# EAGLE design esquemático (EAGLE 9.6.2)
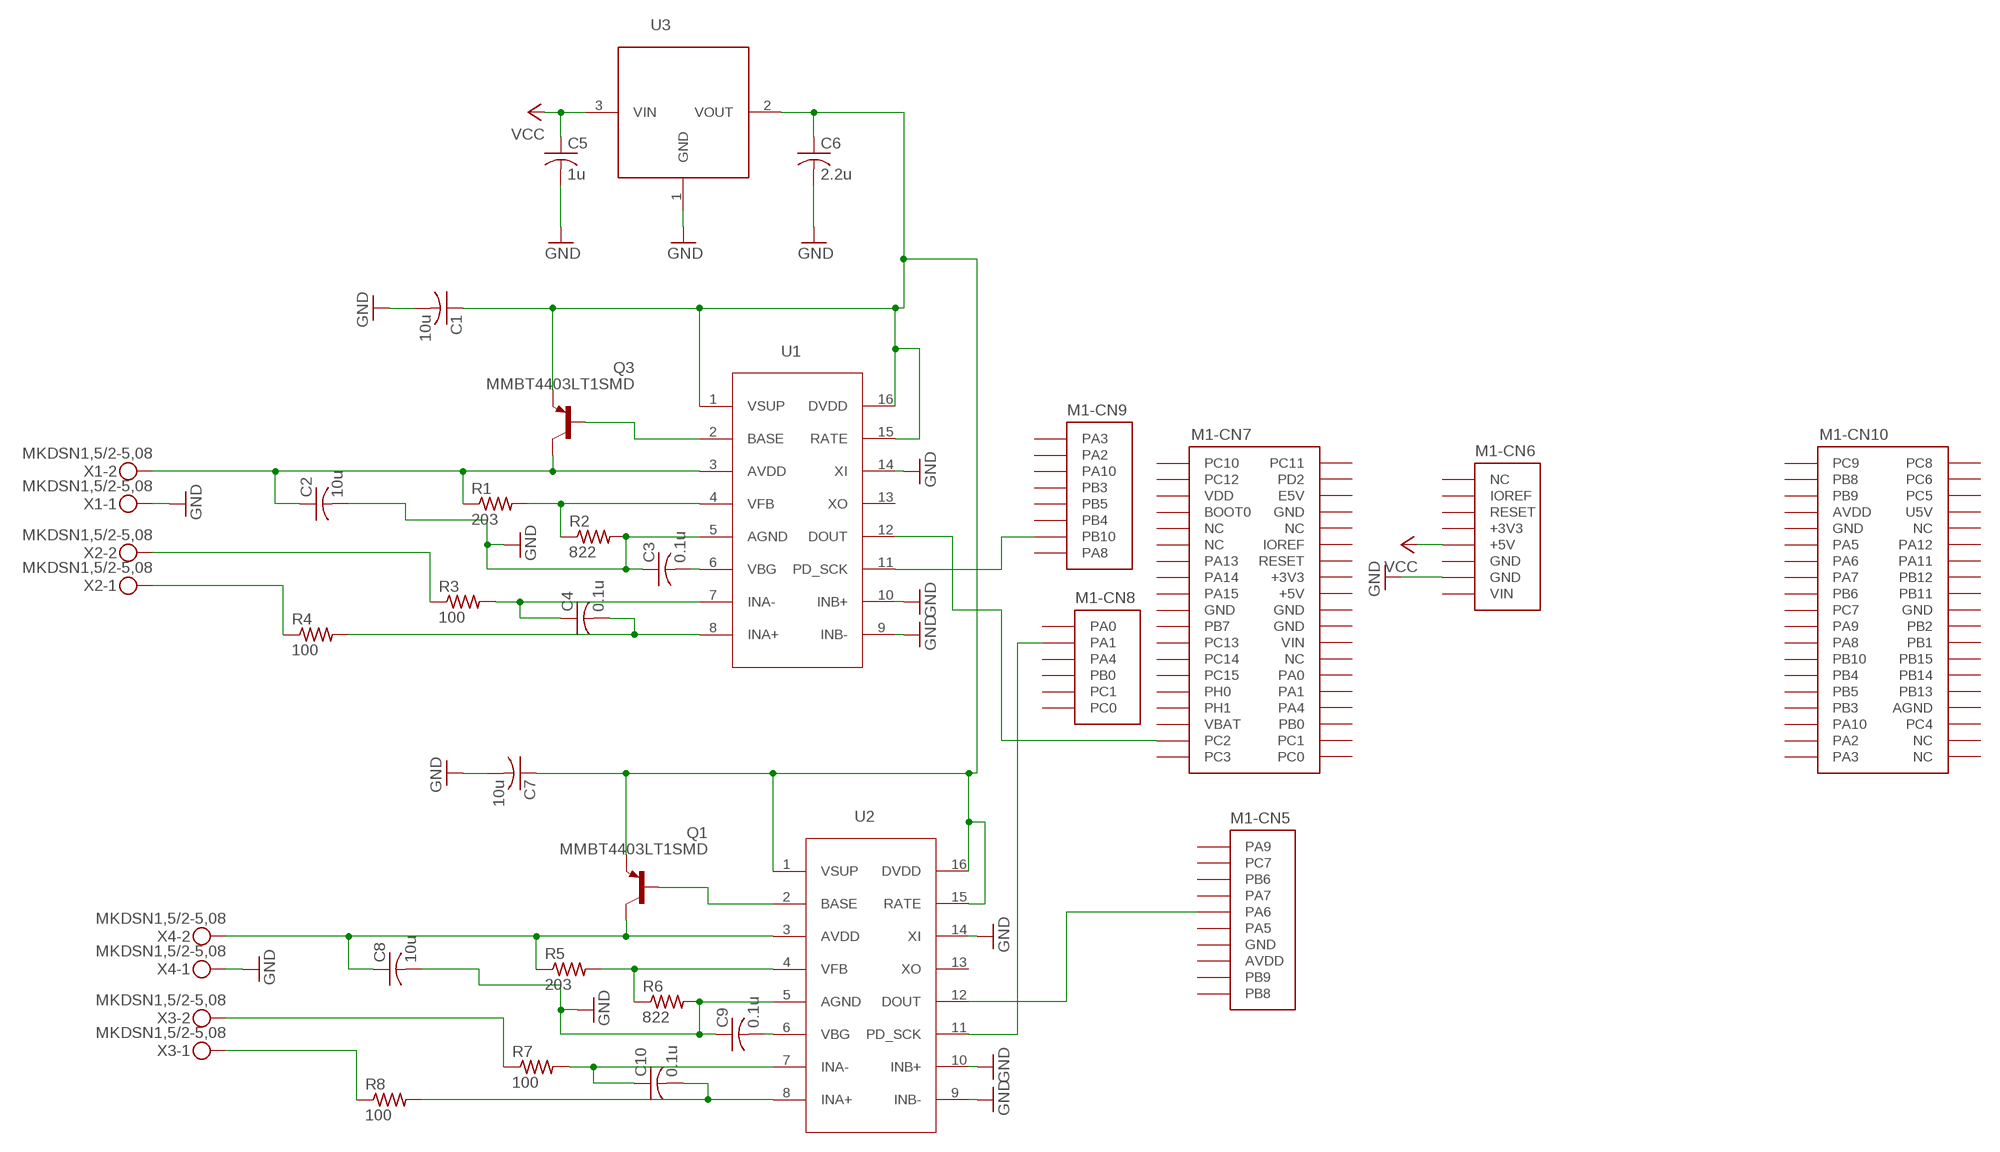
[diagram p0: schematic, sheet 1]

## Parts
C1  10u  C-USC0805  [C0805]
C2  10u  C-USC0805  [C0805]
C3  0.1u  C-USC0805  [C0805]
C4  0.1u  C-USC0805  [C0805]
C5  1u  C-USC0805  [C0805]
C6  2.2u  C-USC0805  [C0805]
C7  10u  C-USC0805  [C0805]
C8  10u  C-USC0805  [C0805]
C9  0.1u  C-USC0805  [C0805]
C10  0.1u  C-USC0805  [C0805]
M1  NUCLEO-L452RE  [NUCLEO-64]
Q1  MMBT4403LT1SMD  [SOT23-BEC]
Q3  MMBT4403LT1SMD  [SOT23-BEC]
R1  203  R-US_R0805  [R0805]
R2  822  R-US_R0805  [R0805]
R3  100  R-US_R0805  [R0805]
R4  100  R-US_R0805  [R0805]
R5  203  R-US_R0805  [R0805]
R6  822  R-US_R0805  [R0805]
R7  100  R-US_R0805  [R0805]
R8  100  R-US_R0805  [R0805]
U1  HX711SOIC127P600X140-16N  [SOIC127P600X140-16N]
U2  HX711SOIC127P600X140-16N  [SOIC127P600X140-16N]
U3  AP2210N-4.0TRG1  [SOT-23-3]
X1  MKDSN1,5/2-5,08  [MKDSN1,5/2-5,08]
X2  MKDSN1,5/2-5,08  [MKDSN1,5/2-5,08]
X3  MKDSN1,5/2-5,08  [MKDSN1,5/2-5,08]
X4  MKDSN1,5/2-5,08  [MKDSN1,5/2-5,08]

## Nets
GND: C1.2 C2.2 C3.1 C5.2 C6.2 C7.2 C8.2 C9.1 M1.CN6-7(-CN6:GND) R2.2 R6.2 U1.5(AGND) U1.9(INB-) U1.10(INB+) U1.14(XI) U2.5(AGND) U2.9(INB-) U2.10(INB+) U2.14(XI) U3.1(GND) X1.1 X4.1
N$1: C2.1 Q3.C R1.1 U1.3(AVDD) X1.2
N$2: C4.1 R3.2 U1.7(INA-)
N$3: M1.CN9-7(-CN9:PB10) U1.11(PD_SCK)
N$4: R1.2 R2.1 U1.4(VFB)
N$5: R3.1 X2.2
N$6: C4.2 R4.2 U1.8(INA+)
N$7: R4.1 X2.1
N$8: C3.2 U1.6(VBG)
N$9: C8.1 Q1.C R5.1 U2.3(AVDD) X4.2
N$10: Q3.B U1.2(BASE)
N$11: R5.2 R6.1 U2.4(VFB)
N$12: C10.1 R7.2 U2.7(INA-)
N$13: R7.1 X3.2
N$14: C10.2 R8.2 U2.8(INA+)
N$15: R8.1 X3.1
N$16: C9.2 U2.6(VBG)
N$17: M1.CN5-5(-CN5:PA6) U2.12(DOUT)
N$18: Q1.B U2.2(BASE)
N$19: M1.CN7-35(-CN7:PC2) U1.12(DOUT)
N$21: M1.CN8-2(-CN8:PA1) U2.11(PD_SCK)
N$22: C1.1 C6.1 C7.1 Q1.E Q3.E U1.1(VSUP) U1.15(RATE) U1.16(DVDD) U2.1(VSUP) U2.15(RATE) U2.16(DVDD) U3.2(VOUT)
VCC: C5.1 M1.CN6-5(-CN6:+5V) U3.3(VIN)
Unconnected: M1.CN5-1(-CN5:PA9) M1.CN5-2(-CN5:PC7) M1.CN5-3(-CN5:PB6) M1.CN5-4(-CN5:PA7) M1.CN5-6(-CN5:PA5) M1.CN5-9(-CN5:PB9) M1.CN5-10(-CN5:PB8) M1.CN6-1(-CN6:NC) M1.CN6-3(-CN6:RESET) M1.CN7-1(-CN7:PC10) M1.CN7-2(-CN7:PC11) M1.CN7-3(-CN7:PC12) M1.CN7-4(-CN7:PD2) M1.CN7-6(-CN7:E5V) M1.CN7-7(-CN7:BOOT0) M1.CN7-9(-CN7:NC) M1.CN7-10(-CN7:NC) M1.CN7-11(-CN7:NC) M1.CN7-12(-CN7:IOREF) M1.CN7-13(-CN7:PA13) M1.CN7-14(-CN7:RESET) M1.CN7-15(-CN7:PA14) M1.CN7-17(-CN7:PA15) M1.CN7-21(-CN7:PB7) M1.CN7-23(-CN7:PC13) M1.CN7-25(-CN7:PC14) M1.CN7-26(-CN7:NC) M1.CN7-27(-CN7:PC15) M1.CN7-28(-CN7:PA0) M1.CN7-29(-CN7:PH0) M1.CN7-30(-CN7:PA1) M1.CN7-31(-CN7:PH1) M1.CN7-32(-CN7:PA4) M1.CN7-34(-CN7:PB0) M1.CN7-36(-CN7:PC1) M1.CN7-37(-CN7:PC3) M1.CN7-38(-CN7:PC0) M1.CN8-1(-CN8:PA0) M1.CN8-3(-CN8:PA4) M1.CN8-4(-CN8:PB0) M1.CN8-5(-CN8:PC1) M1.CN8-6(-CN8:PC0) M1.CN9-1(-CN9:PA3) M1.CN9-2(-CN9:PA2) M1.CN9-3(-CN9:PA10) M1.CN9-4(-CN9:PB3) M1.CN9-5(-CN9:PB5) M1.CN9-6(-CN9:PB4) M1.CN9-8(-CN9:PA8) M1.CN10-1(-CN10:PC9) M1.CN10-2(-CN10:PC8) M1.CN10-3(-CN10:PB8) M1.CN10-4(-CN10:PC6) M1.CN10-5(-CN10:PB9) M1.CN10-6(-CN10:PC5) M1.CN10-10(-CN10:NC) M1.CN10-11(-CN10:PA5) M1.CN10-12(-CN10:PA12) M1.CN10-13(-CN10:PA6) M1.CN10-14(-CN10:PA11) M1.CN10-15(-CN10:PA7) M1.CN10-16(-CN10:PB12) M1.CN10-17(-CN10:PB6) M1.CN10-18(-CN10:PB11) M1.CN10-19(-CN10:PC7) M1.CN10-21(-CN10:PA9) M1.CN10-22(-CN10:PB2) M1.CN10-23(-CN10:PA8) M1.CN10-24(-CN10:PB1) M1.CN10-25(-CN10:PB10) M1.CN10-26(-CN10:PB15) M1.CN10-27(-CN10:PB4) M1.CN10-28(-CN10:PB14) M1.CN10-29(-CN10:PB5) M1.CN10-30(-CN10:PB13) M1.CN10-31(-CN10:PB3) M1.CN10-33(-CN10:PA10) M1.CN10-34(-CN10:PC4) M1.CN10-35(-CN10:PA2) M1.CN10-36(-CN10:NC) M1.CN10-37(-CN10:PA3) M1.CN10-38(-CN10:NC) U1.13(XO) U2.13(XO)

## Power pins joined to a net without a drawn wire
+3V3: M1.CN6-4(-CN6:+3V3) M1.CN7-16(-CN7:+3V3)
+5V: M1.CN7-18(-CN7:+5V)
AGND: M1.CN10-32(-CN10:AGND)
AVDD: M1.CN5-8(-CN5:AVDD) M1.CN10-7(-CN10:AVDD)
GND: M1.CN5-7(-CN5:GND) M1.CN6-6(-CN6:GND) M1.CN7-8(-CN7:GND) M1.CN7-19(-CN7:GND) M1.CN7-20(-CN7:GND) M1.CN7-22(-CN7:GND) M1.CN10-9(-CN10:GND) M1.CN10-20(-CN10:GND)
IOREF: M1.CN6-2(-CN6:IOREF)
U5V: M1.CN10-8(-CN10:U5V)
VBAT: M1.CN7-33(-CN7:VBAT)
VDD: M1.CN7-5(-CN7:VDD)
VIN: M1.CN6-8(-CN6:VIN) M1.CN7-24(-CN7:VIN)

## Library data of the parts
C1-C10 = rcl:C-US: CAPACITOR, American symbol; SPICEPREFIX: C
M1 = NUCLEO-L452RE:NUCLEO-L452RE: No existe un outline (Layer Dimension) para esta librería. En su lugar se utilizó una referencia en tDocu. Al momento de diseñar la tarjeta, el Dimension debe ser dibujado según los requerimientos del usuario, o simplemente copiar los contenidos del tDocu en Dimensions.
Q1 Q3 = transistor-pnp:MMBT4403*: PNP Transistror; PARTNO: BCR573E6327
R1-R8 = rcl:R-US_: RESISTOR, American symbol; SPICEPREFIX: R
U1 U2 = HX711:HX711; PARTNO: HX711
U3 = Celda_Carga:AP2210N-4.0TRG1; PARTNO: AP2210N-4.0TRG1
X1-X4 = 1729128 - PHOENIX CONTACT:MKDSN1,5/2-5,08: MKDSN 1,5/ 2-5,08 Printklemme Nennstrom: 13,5 A Nennspannung: 250 V Rastermaß: 5,08 mm Polzahl: 2 Anschlussart: Schraubanschluss Montage: Löten Anschlussrichtung Leiter/Platine: 0 ° Artikelnummer: 1729128 Source: http://eshop.phoenixcontact.com .. 1729128.pdf; PARTNO: MKDSN1,5/2-5,08

## Board
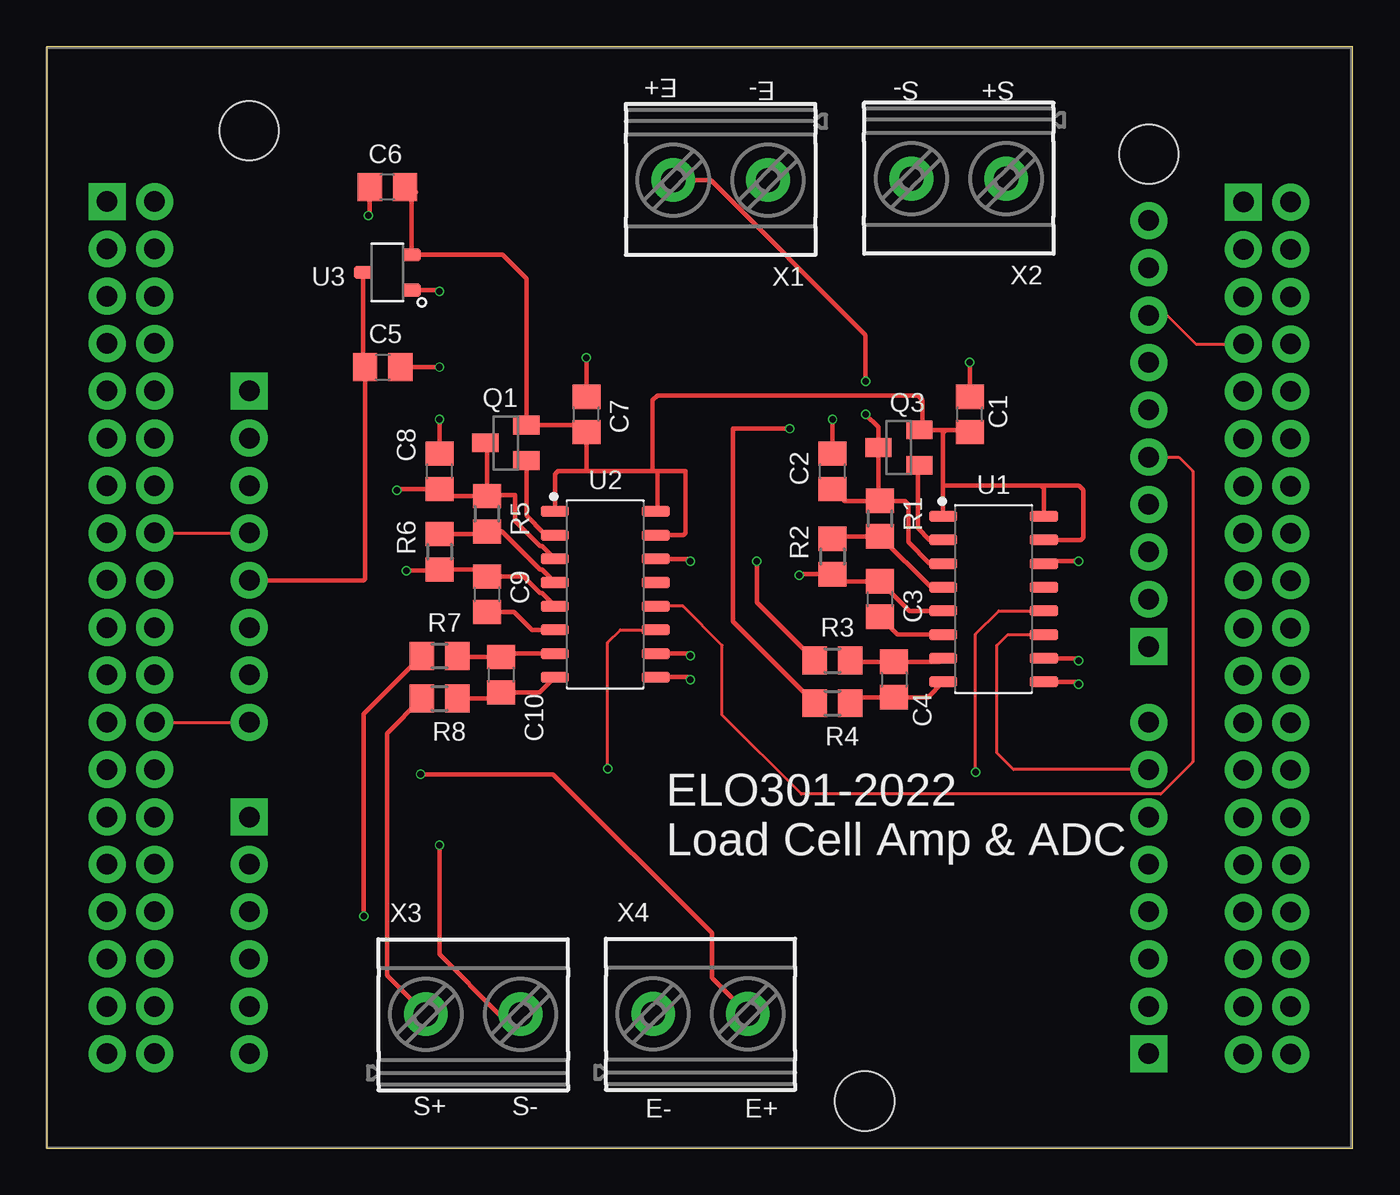
[diagram p1: board, top side]
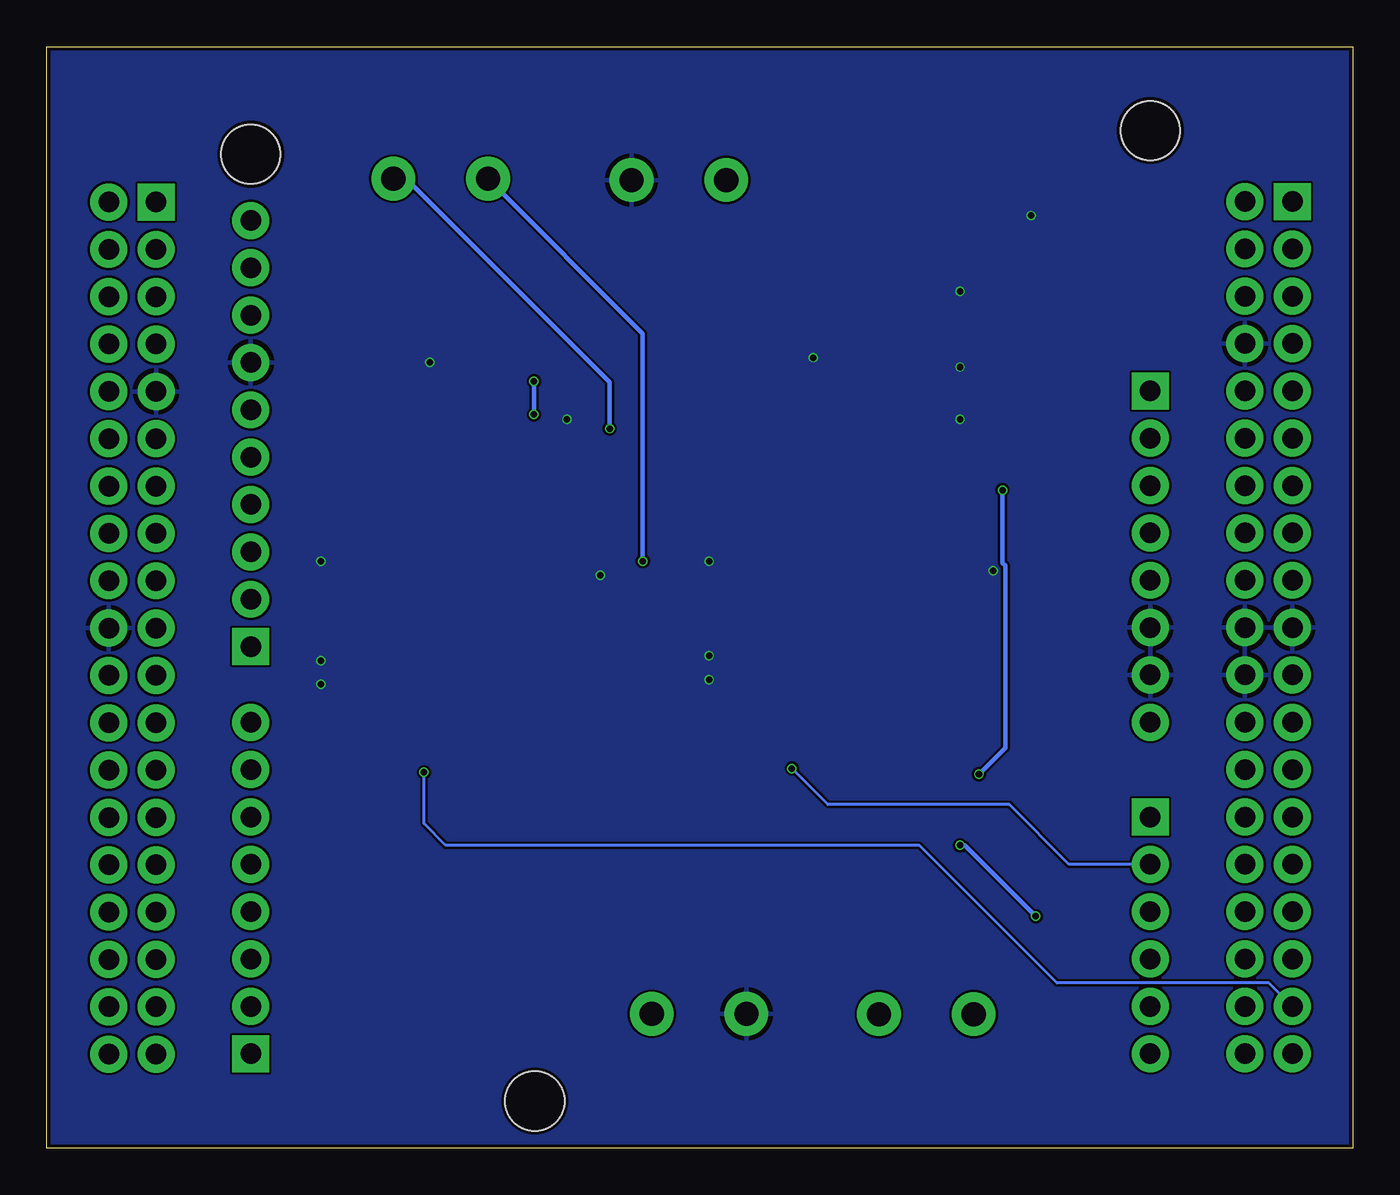
[diagram p2: board, bottom side, seen from below]

Size 70.08 x 59.11 mm. Coordinates in mm from the lower left corner, seen from the top.
Outline: 0,0 70.08,0 70.08,59.11 0,59.11 0,0
Copper layers (1*16): Top 0.035mm / dielectric 1.6mm / Bottom 0.035mm
Design rules "jlcpcb-2layers *": minimum track width 5mil, minimum drill 0.3mm, track to track 5mil, track to pad 5mil, pad to pad 5mil, via to via 5mil, smd to smd 5mil, copper to edge 0.2mm, drill to drill 6mil, minimum pad ring 10mil, minimum via ring 3mil, stop-mask expansion 4mil, vias tented up to drill 15mil, thermal gap 10mil

### Footprints (pad centres in the part's own frame; a part is rotated, then mirrored left to right if it is on the bottom)
C0805 = smd 1.3 x 1.5: 1 -0.95,0; 2 0.95,0
NUCLEO-64 = drill 1.1 pad 1.85 square: CN5-1 59.13,24.884; CN6-1 10.87,38.6; CN7-1 3.25,48.76; CN8-1 10.87,15.74; CN9-1 59.13,3.04; CN10-1 64.21,48.735 | drill 1.1 pad 1.85: CN5-2 59.13,27.424; CN5-3 59.13,29.964; CN5-4 59.13,32.504; CN5-5 59.13,35.044; CN5-6 59.13,37.584; CN5-7 59.13,40.124; CN5-8 59.13,42.664; CN5-9 59.13,45.204; CN5-10 59.13,47.744; CN6-2 10.87,36.06; CN6-3 10.87,33.52; CN6-4 10.87,30.98; CN6-5 10.87,28.44; CN6-6 10.87,25.9; CN6-7 10.87,23.36; CN6-8 10.87,20.82; CN7-2 5.79,48.76; CN7-3 3.25,46.22; CN7-4 5.79,46.22; CN7-5 3.25,43.68; CN7-6 5.79,43.68; CN7-7 3.25,41.14; CN7-8 5.79,41.14; CN7-9 3.25,38.6; CN7-10 5.79,38.6; CN7-11 3.25,36.06; CN7-12 5.79,36.06; CN7-13 3.25,33.52; CN7-14 5.79,33.52; CN7-15 3.25,30.98; CN7-16 5.79,30.98; CN7-17 3.25,28.44; CN7-18 5.79,28.44; CN7-19 3.25,25.9; CN7-20 5.79,25.9; CN7-21 3.25,23.36; CN7-22 5.79,23.36; CN7-23 3.25,20.82; CN7-24 5.79,20.82; CN7-25 3.25,18.28; CN7-26 5.79,18.28; CN7-27 3.25,15.74; CN7-28 5.79,15.74; CN7-29 3.25,13.2; CN7-30 5.79,13.2; CN7-31 3.25,10.66; CN7-32 5.79,10.66; CN7-33 3.25,8.12; CN7-34 5.79,8.12; CN7-35 3.25,5.58; CN7-36 5.79,5.58; CN7-37 3.25,3.04; CN7-38 5.79,3.04; CN8-2 10.87,13.2; CN8-3 10.87,10.66; CN8-4 10.87,8.12; CN8-5 10.87,5.58; CN8-6 10.87,3.04; CN9-2 59.13,5.58; CN9-3 59.13,8.12; CN9-4 59.13,10.66; CN9-5 59.13,13.2; CN9-6 59.13,15.74; CN9-7 59.13,18.28; CN9-8 59.13,20.82; CN10-2 66.75,48.735; CN10-3 64.21,46.195; CN10-4 66.75,46.195; CN10-5 64.21,43.655; CN10-6 66.75,43.655; CN10-7 64.21,41.115; CN10-8 66.75,41.115; CN10-9 64.21,38.575; CN10-10 66.75,38.575; CN10-11 64.21,36.035; CN10-12 66.75,36.035; CN10-13 64.21,33.495; CN10-14 66.75,33.495; CN10-15 64.21,30.955; CN10-16 66.75,30.955; CN10-17 64.21,28.415; CN10-18 66.75,28.415; CN10-19 64.21,25.875; CN10-20 66.75,25.875; CN10-21 64.21,23.335; CN10-22 66.75,23.335; CN10-23 64.21,20.795; CN10-24 66.75,20.795; CN10-25 64.21,18.255; CN10-26 66.75,18.255; CN10-27 64.21,15.715; CN10-28 66.75,15.715; CN10-29 64.21,13.175; CN10-30 66.75,13.175; CN10-31 64.21,10.635; CN10-32 66.75,10.635; CN10-33 64.21,8.095; CN10-34 66.75,8.095; CN10-35 64.21,5.555; CN10-36 66.75,5.555; CN10-37 64.21,3.015; CN10-38 66.75,3.015 | hole 3.175: 59.13,51.3; 10.87,52.57; 43.89,0.5
SOT23-BEC = smd 1 x 1.4: B -0.95,-1.1; C 0,1.1; E 0.95,-1.1
R0805 = smd 1.3 x 1.5: 1 -0.95,0; 2 0.95,0
SOIC127P600X140-16N = smd 1.509 x 0.594: 1 -2.703,4.445; 2 -2.703,3.175; 3 -2.703,1.905; 4 -2.703,0.635; 5 -2.703,-0.635; 6 -2.703,-1.905; 7 -2.703,-3.175; 8 -2.703,-4.445; 9 2.703,-4.445; 10 2.703,-3.175; 11 2.703,-1.905; 12 2.703,-0.635; 13 2.703,0.635; 14 2.703,1.905; 15 2.703,3.175; 16 2.703,4.445
SOT-23-3 = smd 0.7 x 1: 1 -0.95,-1.3; 2 0.95,-1.3; 3 0,1.3
MKDSN1,5/2-5,08 = drill 1.3 pad 2: 1 -2.561,0.025; 2 2.519,0.025

### Placement (x,y rotation side)
C1  49.53,39.37 90 top
C2  42.16,36.32 90 top
C3  44.7,29.46 270 top
C4  45.47,25.15 270 top
C5  18.03,41.91 0 top
C6  18.29,51.56 180 top
C7  28.96,39.37 90 top
C8  21.08,36.32 90 top
C9  23.62,29.72 270 top
C10  24.38,25.4 270 top
M1  0,2.03 0 top
Q1  24.64,37.85 90 top
Q3  45.72,37.59 90 top
R1  44.7,33.78 270 top
R2  42.16,31.75 270 top
R3  42.16,26.16 0 top
R4  42.16,23.88 0 top
R5  23.62,34.04 270 top
R6  21.08,32 270 top
R7  21.08,26.42 0 top
R8  21.08,24.13 0 top
U1  50.8,29.46 0 top
U2  29.97,29.72 0 top
U3  18.29,46.99 90 top
X1  36.14,51.97 180 top
X2  48.92,52.04 180 top
X3  22.91,7.16 0 top
X4  35.1,7.19 0 top

### Tracks (layer width: path | path; a pad name or v marks a point on that pad's centre or on a via)
+3V3
  Top 0.152: M1.CN7-16 M1.CN6-4
AVDD
  Top 0.152: M1.CN5-8 60.1,44.7 61.65,43.15 M1.CN10-7
GND  (via drill 0.35)
  Top 0.254: U2.5 26.57,29.78 26.48,29.78 25.59,30.67 C9.1 23.24,31.05 R6.2 21.02,30.99 v19.3,30.99 | C7.2 v28.96,42.42 | C8.2 v21.08,39.12 | C5.2 v21.08,41.91 | U3.1 21.02,46.04 v21.08,45.97 | U2.14 34.42,31.62 v34.54,31.5 | U2.9 34.42,25.27 v34.54,25.15 | U2.10 34.42,26.54 v34.54,26.42 | C6.2 17.34,50.1 v17.27,50.04 | U1.5 46.29,28.83 C3.1 42.55,30.41 R2.2 40.45,30.8 v40.39,30.73 | C2.2 v42.16,39.12 | U1.14 53.63,31.5 v55.37,31.5 | C1.2 v49.53,42.16 | U1.10 55.24,26.29 v55.37,26.16 | U1.9 55.24,25.02 v55.37,24.89
  pour Bottom: 0,58.99 70.1,58.99 70.1,0 0,0
N$1  (via drill 0.35)
  Top 0.254: U1.3 47.37,31.37 46.23,32.51 46.23,34.54 46.04,34.73 R1.1 | R1.1 44.62,34.82 Q3.C 44.62,38.69 v43.94,39.37 | R1.1 42.8,34.73 C2.1 | v43.94,41.15 43.94,43.64 35.64,51.94 X1.2
  Bottom 0.254: v43.94,39.37 v43.94,41.15
N$2
  Top 0.254: U1.7 47.9,26.1 C4.1 43.18,26.1 R3.2
N$3
  Top 0.152: M1.CN9-7 51.88,20.31 50.98,21.21 50.98,26.98 51.56,27.56 U1.11
N$4
  Top 0.254: U1.4 47.44,30.1 R1.2 42.3,32.83 R2.1
N$5  (via drill 0.35)
  Top 0.254: R3.1 38.1,29.28 v38.1,31.5
  Bottom 0.254: v38.1,31.5 38.1,43.72 X2.2
N$6
  Top 0.254: U1.8 47.27,24.2 C4.2 43.43,24.2 R4.2
N$7  (via drill 0.35)
  Top 0.254: R4.1 36.83,28.26 36.83,38.61 v39.88,38.61
  Bottom 0.254: v39.88,38.61 39.88,41.1 50.8,52.02 X2.1
N$8
  Top 0.254: U1.6 45.66,27.56 C3.2
N$9  (via drill 0.35)
  Top 0.254: U2.3 26.57,32.32 26.48,32.32 25.15,33.66 25.15,35.05 23.69,35.05 R5.1 | R5.1 21.47,34.99 C8.1 18.86,35.37 v18.8,35.31 | R5.1 23.62,37.76 Q1.C | v20.07,20.07 27.18,20.07 35.69,11.56 35.69,9.15 X4.2
  Bottom 0.254: v18.8,35.31 18.8,31.41 18.65,31.26 18.65,21.49 v20.07,20.07
N$10
  Top 0.254: U1.2 47.37,32.64 46.74,33.27 46.74,36.56 Q3.B
N$11
  Top 0.254: U2.4 26.57,31.05 26.48,31.05 24.45,33.09 R5.2 23.49,32.95 R6.1
N$12
  Top 0.254: U2.7 24.58,26.54 C10.1 22.1,26.35 R7.2
N$13  (via drill 0.35)
  Top 0.254: R7.1 17.02,23.3 v17.02,12.45 | v21.08,16.26 21.08,10.39 24.28,7.19 X3.2
  Bottom 0.254: v17.02,12.45 20.83,16.26 v21.08,16.26
N$14
  Top 0.254: U2.8 26.45,24.45 C10.2 24.06,24.13 R8.2
N$15
  Top 0.254: R8.1 18.27,22.27 18.27,9.27 X3.1
N$16
  Top 0.254: U2.6 26.04,27.81 25.08,28.77 C9.2
N$17
  Top 0.152: M1.CN5-5 60.74,37.08 61.49,36.32 61.49,20.73 59.77,19 40.49,19 36.25,23.24 36.25,26.98 34.14,29.08 U2.12
N$18
  Top 0.254: 26.67,33.02 26.67,32.77 27.14,32.77 U2.2 26.8,32.89 26.67,33.02 | Q1.B 25.74,33.95 26.67,33.02
N$19  (via drill 0.35)
  Top 0.152: v49.84,20.17 49.84,27.58 51.08,28.83 U1.12
  Bottom 0.152: M1.CN7-35 4.5,8.87 15.88,8.87 23.27,16.26 48.67,16.26 49.84,17.42 v49.84,20.17
N$21  (via drill 0.35)
  Top 0.152: v30.1,20.37 30.1,27.13 30.79,27.81 U2.11
  Bottom 0.152: M1.CN8-2 15.23,15.23 18.44,18.44 28.17,18.44 v30.1,20.37
N$22
  Top 0.254: U2.1 27.27,36.16 27.43,36.32 28.96,36.32 | 28.96,36.32 32.51,36.32 | 32.51,36.32 32.77,36.32 | 32.77,36.32 32.77,34.25 U2.16 | 28.96,36.32 C7.1 28.58,38.8 Q1.E 25.74,46.65 24.45,47.94 U3.2 19.59,51.08 19.81,51.31 19.56,51.56 C6.1 | Q3.E 46.99,38.54 | 46.99,38.54 48.26,38.54 | 48.26,38.54 49.41,38.54 C1.1 | U1.1 48.1,35.56 | 48.1,35.56 48.1,38.38 48.26,38.54 | U1.16 53.5,35.4 53.34,35.56 | 53.34,35.56 53.09,35.56 48.1,35.56 | 32.51,36.32 32.51,40.13 32.77,40.39 46.74,40.39 46.99,40.13 46.99,38.54 | U2.15 34.16,32.89 34.29,33.02 34.29,36.32 32.77,36.32 | U1.15 55.5,32.64 55.63,32.77 55.63,35.31 55.37,35.56 53.34,35.56
VCC
  Top 0.254: M1.CN6-5 17.01,30.47 17.08,30.55 C5.1 16.99,42.01 U3.3
VIN
  Top 0.152: M1.CN7-24 M1.CN6-8

### Text on the board
tPlace: E+ | E- | S- | S+ | ELO301-2022 / Load Cell Amp & ADC | S+ | S- | E- | E+